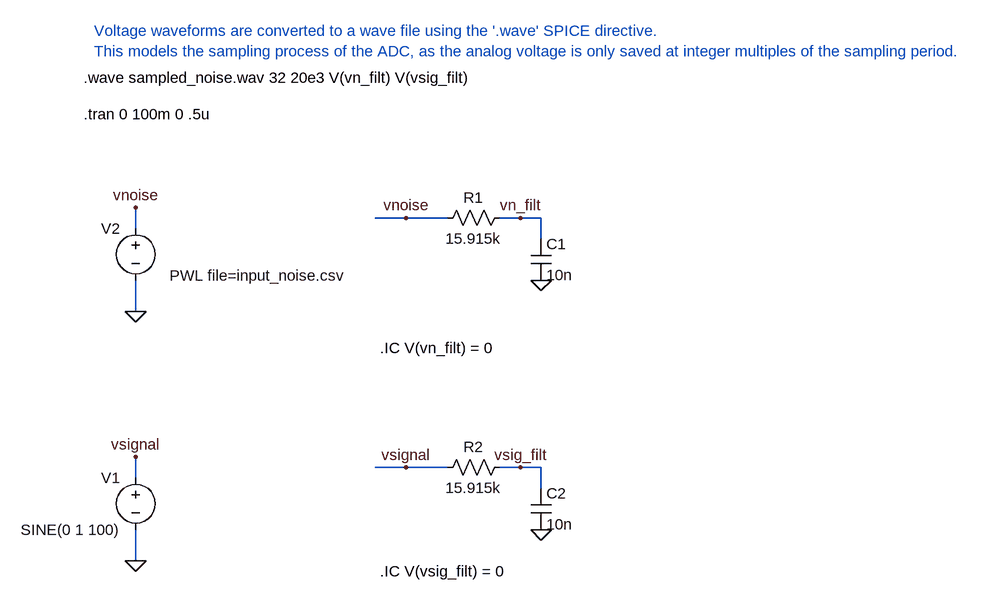
[diagram p0: schematic noise_sampling_duo.asc]
noise_sampling_duo.asc, the LTspice schematic file:
Version 4
SHEET 1 1520 696
WIRE 496 96 448 96
WIRE 560 96 496 96
WIRE 672 96 640 96
WIRE 704 96 672 96
WIRE 80 112 80 80
WIRE 704 128 704 96
WIRE 80 240 80 192
WIRE 496 480 448 480
WIRE 560 480 496 480
WIRE 672 480 640 480
WIRE 704 480 672 480
WIRE 80 496 80 464
WIRE 704 512 704 480
WIRE 80 624 80 576
FLAG 80 80 vnoise
FLAG 80 240 0
FLAG 704 192 0
FLAG 672 96 vn_filt
FLAG 496 96 vnoise
FLAG 80 464 vsignal
FLAG 80 624 0
FLAG 704 576 0
FLAG 672 480 vsig_filt
FLAG 496 480 vsignal
SYMBOL voltage 80 96 M0
WINDOW 123 0 0 Left 0
WINDOW 39 0 0 Left 0
WINDOW 3 -322 89 Left 2
SYMATTR Value PWL file=input_noise.csv
SYMATTR InstName V2
SYMBOL cap 688 128 R0
SYMATTR InstName C1
SYMATTR Value 10n
SYMBOL res 656 80 R90
WINDOW 0 0 56 VBottom 2
WINDOW 3 32 56 VTop 2
SYMATTR InstName R1
SYMATTR Value 15.915k
SYMBOL voltage 80 480 M0
WINDOW 123 0 0 Left 0
WINDOW 39 0 0 Left 0
SYMATTR InstName V1
SYMATTR Value SINE(0 1 100)
SYMBOL cap 688 512 R0
SYMATTR InstName C2
SYMATTR Value 10n
SYMBOL res 656 464 R90
WINDOW 0 0 56 VBottom 2
WINDOW 3 32 56 VTop 2
SYMATTR InstName R2
SYMATTR Value 15.915k
TEXT 0 -120 Left 2 !.wave sampled_noise.wav 32 20e3 V(vn_filt) V(vsig_filt)
TEXT 0 -64 Left 2 !.tran 0 100m 0 .5u
TEXT 456 296 Left 2 !.IC V(vn_filt) = 0
TEXT 456 640 Left 2 !.IC V(vsig_filt) = 0
TEXT 16 -192 Left 2 ;Voltage waveforms are converted to a wave file using the '.wave' SPICE directive. \nThis models the sampling process of the ADC, as the analog voltage is only saved at integer multiples of the sampling period.

The netlist it stands for:
* noise_sampling_duo.asc
V2 vnoise 0 PWL file=input_noise.csv
C1 vn_filt 0 10n
R1 vn_filt vnoise 15.915k
V1 vsignal 0 SINE(0 1 100)
C2 vsig_filt 0 10n
R2 vsig_filt vsignal 15.915k
.wave sampled_noise.wav 32 20e3 V(vn_filt) V(vsig_filt)
.tran 0 100m 0 .5u
.IC V(vn_filt) = 0
.IC V(vsig_filt) = 0
* Voltage waveforms are converted to a wave file using the '.wave' SPICE directive.
* This models the sampling process of the ADC, as the analog voltage is only saved at integer multiples of the sampling period.
.backanno
.end